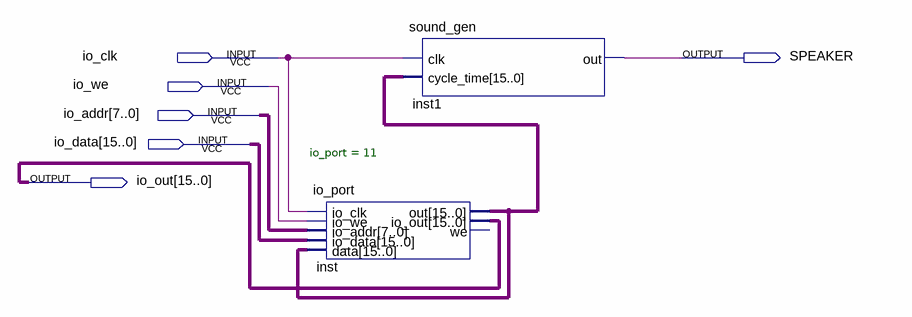
[diagram p0: schematic sheet]
// Quartus schematic sound_io.bdf as structural Verilog: 2 symbols, 6 pins
module sound_io (
  input  io_clk,
  input  io_we,
  input  [7:0] io_addr,
  input  [15:0] io_data,
  output SPEAKER,
  output [15:0] io_out
);

  wire [15:0] inst_out;

  io_port #(.io_port(11)) inst (
    .io_clk(io_clk), .io_we(io_we), .io_addr(io_addr), .io_data(io_data), .data(inst_out), .out(inst_out),
    .io_out(io_out));  // open: we
  sound_gen inst1 (.clk(io_clk), .cycle_time(inst_out), .out(SPEAKER));
endmodule
